# EAGLE design stl2-1_shield (EAGLE 7.2.0)
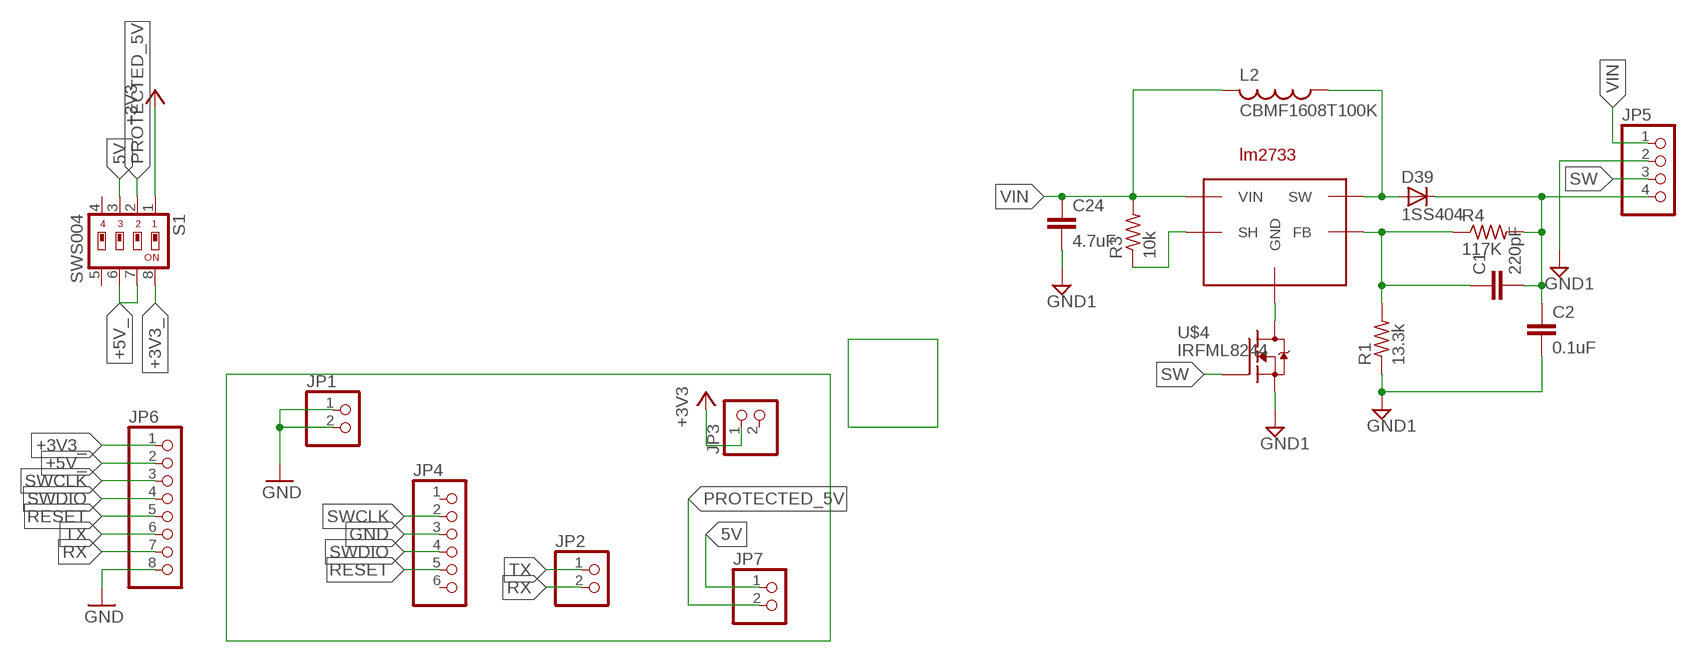
[diagram p0: schematic, sheet 1]

## Parts
C1  220pF  C-EUC0603K  [C0603K]
C2  0.1uF  C-EUC0603K  [C0603K]
C24  4.7uF  C-EUC0603K  [C0603K]
D39  1SS404  [USC(1.25X2.5)]
JP1  PINHD-1X2  [1X02]
JP2  PINHD-1X2  [1X02]
JP3  PINHD-1X2  [1X02]
JP4  PINHD-1X6  [1X06]
JP5  PINHD-1X4  [1X04]
JP6  PINHD-1X8/90  [1X08/90]
JP7  PINHD-1X2  [1X02]
L2  CBMF1608T100K  L-USL2012C  [L2012C]
R1  13.3k  R-US_R0603  [R0603]
R3  10k  R-US_R0603  [R0603]
R4  117K  R-US_R0603  [R0603]
S1  SWS004  [SMS-004]
U$1  LM2733  [SOT23-5]
U$4  IRFML8244  [SOT23]

## Nets
5V: JP7.1 S1.3
+3V3: JP3.1 S1.1
+3V3_: JP6.1 S1.8
+5V_: JP6.2 S1.6 S1.7
GND: JP1.1 JP1.2 JP4.3 JP6.8
GND1: C2.2 C24.2 JP5.2 R1.1 U$4.2(S)
N$3: D39.A L2.1 U$1.SW
N$4: R3.1 U$1.SH
N$5: C1.2 C2.1 D39.K(C) JP5.4 R4.2
N$6: C1.1 R1.2 R4.1 U$1.FB
N$8: U$1.GND U$4.3(D)
PROTECTED_5V: JP7.2 S1.2
RESET: JP4.5 JP6.5
RX: JP2.2 JP6.7
SW: JP5.3 U$4.1(G)
SWCLK: JP4.2 JP6.3
SWDIO: JP4.4 JP6.4
TX: JP2.1 JP6.6
VIN: C24.1 JP5.1 L2.2 R3.2 U$1.VIN
Unconnected: JP3.2 JP4.1 JP4.6 S1.4 S1.5

## Library data of the parts
C1 C2 C24 = resistor:C-EU: CAPACITOR, European symbol
D39 = Diode:1SS404
JP1-JP3 JP7 = pinhead:PINHD-1X2: PIN HEADER
JP4 = pinhead:PINHD-1X6: PIN HEADER
JP5 = pinhead:PINHD-1X4: PIN HEADER
JP6 = pinhead:PINHD-1X8: PIN HEADER
L2 = rcl:L-US: INDUCTOR, American symbol
R1 R3 R4 = resistor:R-US_: RESISTOR, American symbol
S1 = smd-special:SWS004: SMD Dip Switch 4 pol.
U$1 = lm2733:LM2733
U$4 = transistor-fet:IRFML8244

## Board
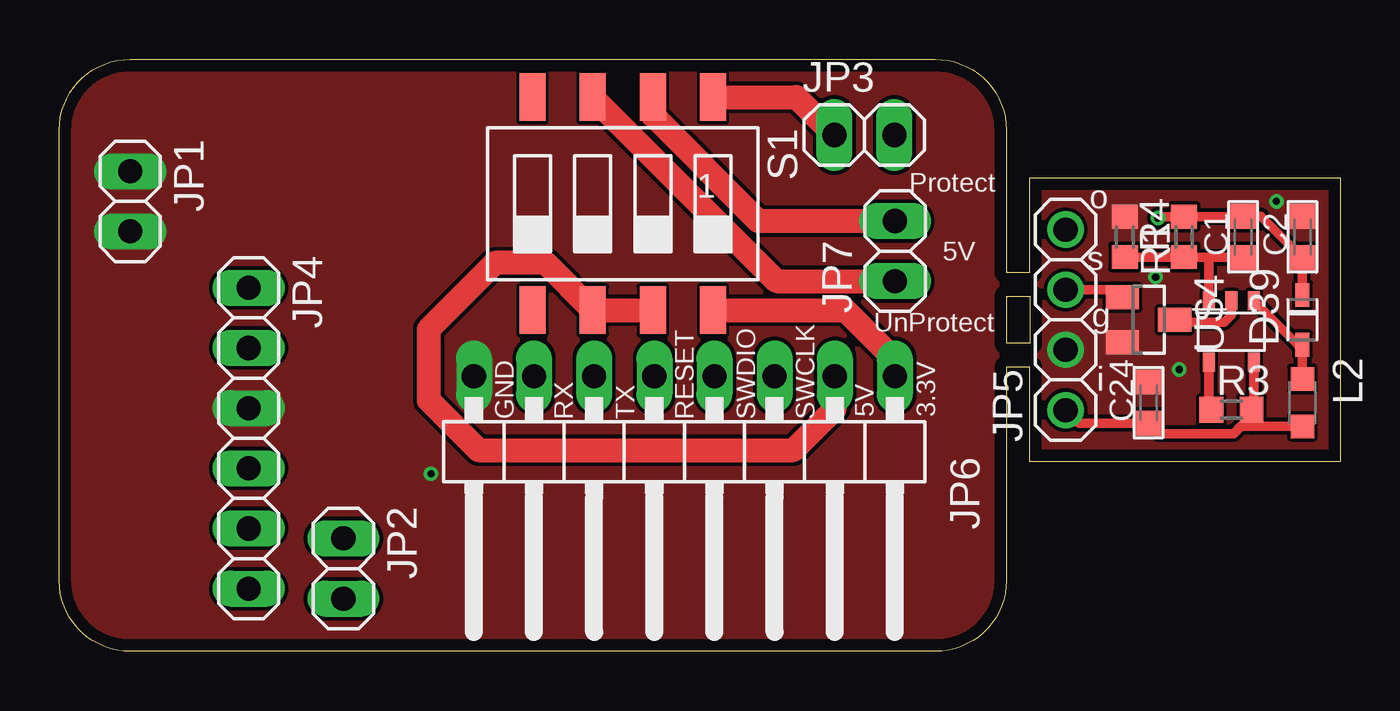
[diagram p1: board, top side]
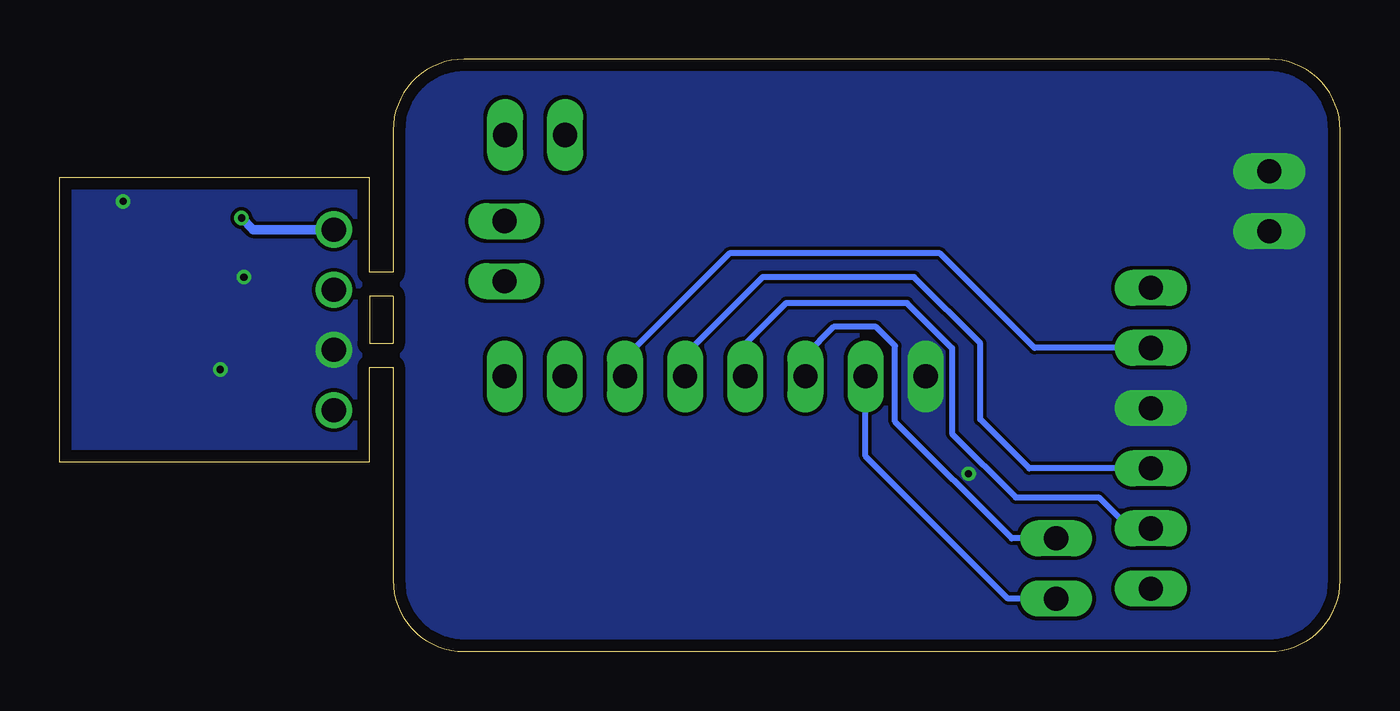
[diagram p2: board, bottom side, seen from below]

Size 54.1 x 25 mm. Coordinates in mm from the lower left corner, seen from the top.
Outline: 0,22 arc-90 3,25 37,25 arc-90 40,22 40,16 41,16 41,20 54.1,20 54.1,8 41,8 41,12 40,12 40,3 arc-90 37,0 3,0 arc-90 0,3 0,22
Outline: 40,15 40,13 41,13 41,15 40,15
Copper layers (1*16): Top 0.035mm / dielectric 1.6mm / Bottom 0.035mm
Design rules "Elecrow_2-layer_PCB_eagle_rule": minimum track width 6mil, minimum drill 12mil, track to track 6mil, track to pad 6mil, pad to pad 6mil, via to via 8mil, smd to smd 0mil, copper to edge 20mil, drill to drill 10mil, minimum pad ring 6mil, minimum via ring 6mil, stop-mask expansion 0mil, vias tented up to drill 100mil, thermal gap 10mil

### Footprints (pad centres in the part's own frame; a part is rotated, then mirrored left to right if it is on the bottom)
C0603K = smd 1.05 x 1.08: 1 -0.875,0; 2 0.875,0
USC(1.25X2.5) = smd 1 x 0.6: A -1.05,0; K 1.05,0
1X02 = drill 1.016 long: 1 -1.27,0; 2 1.27,0
1X06 = drill 1.016 long: 1 -6.35,0; 2 -3.81,0; 3 -1.27,0; 4 1.27,0; 5 3.81,0; 6 6.35,0
1X04 = drill 1.016: 1 -3.81,0; 2 -1.27,0; 3 1.27,0; 4 3.81,0
1X08/90 = drill 1.016 long: 1 -8.89,-3.81; 2 -6.35,-3.81; 3 -3.81,-3.81; 4 -1.27,-3.81; 5 1.27,-3.81; 6 3.81,-3.81; 7 6.35,-3.81; 8 8.89,-3.81
L2012C = smd 1 x 1: 1 -1,0; 2 1,0
R0603 = smd 1 x 1.1: 1 -0.85,0; 2 0.85,0
SMS-004 = smd 1.092 x 2.007: 1 -3.81,-4.496; 2 -1.27,-4.496; 3 1.27,-4.496; 4 3.81,-4.496; 5 3.81,4.496; 6 1.27,4.496; 7 -1.27,4.496; 8 -3.81,4.496
SOT23-5 = smd 0.5 x 0.8: FB 0.95,-1.3; GND 0,-1.3; SH 0.95,1.3; SW -0.95,-1.3; VIN -0.95,1.3
SOT23 = smd 1 x 1.4: 1 -0.95,-1.1; 2 0.95,-1.1; 3 0,1.1

### Placement (x,y rotation side)
C1  50,17.5 90 top
C2  52.5,17.5 90 top
C24  46,10.5 90 top
D39  52.5,14 90 top
JP1  3,19 270 top
JP2  12,3.5 270 top
JP3  34,21.8 0 top
JP4  8,9 270 top
JP5  42.5,14 90 top
JP6  26.4,7.8 180 top
JP7  35.3,16.9 90 top
L2  52.5,10.5 270 top
R1  45,17.5 270 top
R3  49.5,10.2 0 top
R4  47.5,17.5 90 top
S1  23.8,18.9 180 top
U$1  49.5,13.5 180 top
U$4  46,14 270 top

### Tracks (layer width: path | path; a pad name or v marks a point on that pad's centre or on a via)
5V
  Top 1.016: S1.3 30.3,15.63 JP7.1
+3V3
  Top 1.016: S1.1 31.13,23.4 JP3.1
+3V3_
  Top 1.016: S1.8 33.2,14.4 35.29,12.31 JP6.1
+5V_
  Top 1.016: JP6.2 32.75,10.25 31,8.5 17.7,8.5 15.6,10.6 15.6,13.6 18.4,16.4 20.53,16.4 S1.6 S1.7
GND  (via drill 0.3)
  other vias: 15.7,7.5
  pour Bottom (rank 6, no thermals): -2,27.8 43.5,27.8 43.5,-3.2 -2,-3.2
  pour Top (rank 6, no thermals): -1.1,26.8 41.8,26.8 41.8,-1.8 -1.1,-1.8
GND1  (via drill 0.3)
  other vias: 46.3,15.8 51.4,19 47.3,11.9
  pour Bottom (rank 3, no thermals): 41,22 68,22 68,-2 41,-2
  pour Top (rank 3, no thermals): 41,20.5 65.5,20.5 65.5,3.5 41,3.5
N$3
  Top 0.406: L2.1 D39.A 52.3,12.95 U$1.SW
N$4
  Top 0.406: U$1.SH 48.55,10.3 R3.1
N$5  (via drill 0.3)
  Top 0.406: D39.K C2.1 50.75,18.38 C1.2 49.98,18.35 R4.2 46.45,18.35 v46.4,18.3
  Bottom 0.406: v46.4,18.3 45.91,17.81 JP5.4
N$6
  Top 0.406: R1.2 R4.1 48.5,16.65 | 48.5,16.65 49.98,16.65 C1.1 | U$1.FB 48.55,16.6 48.5,16.65
N$8
  Top 0.406: U$1.GND 49.5,14.2 49.2,13.9 47.2,13.9 U$4.3
PROTECTED_5V
  Top 1.016: JP7.2 29.53,18.17 25.07,22.63 S1.2
RESET
  Bottom 0.254: JP6.5 25.13,12.97 23.4,14.7 18.3,14.7 16.4,12.8 16.4,9.2 13.7,6.5 10.2,6.5 8.89,5.19 JP4.5
RX
  Bottom 0.254: JP2.2 14.03,2.23 20.05,8.25 JP6.7
SW
  Top 0.406: JP5.3 44.58,15.27 U$4.1
SWCLK
  Bottom 0.254: JP4.2 12.91,12.81 16.9,16.8 25.8,16.8 30.21,12.39 JP6.3
SWDIO
  Bottom 0.254: JP4.4 13.13,7.73 15.2,9.8 15.2,13 18,15.8 24.4,15.8 27.67,12.53 JP6.4
TX
  Bottom 0.254: JP2.1 13.87,4.77 18.8,9.7 18.8,12.9 19.6,13.7 21.4,13.7 22.59,12.51 JP6.6
VIN
  Top 0.406: U$1.VIN 50.45,10.3 R3.2 50.35,9.55 50.4,9.5 | L2.2 50.4,9.5 | 50.4,9.5 49.9,9.5 49.6,9.2 46.42,9.2 C24.1 43.06,9.62 JP5.1

### Text on the board
tPlace: o | s | g | i
tNames: Protect | 5V | UnProtect | GND | RX | TX | RESET | SWDIO | SWCLK | 5V | 3.3V